# EAGLE design photodiode-opamp-tester-mk-2.0 (EAGLE 7.5.0)
AUTHOR: sean@yak.net
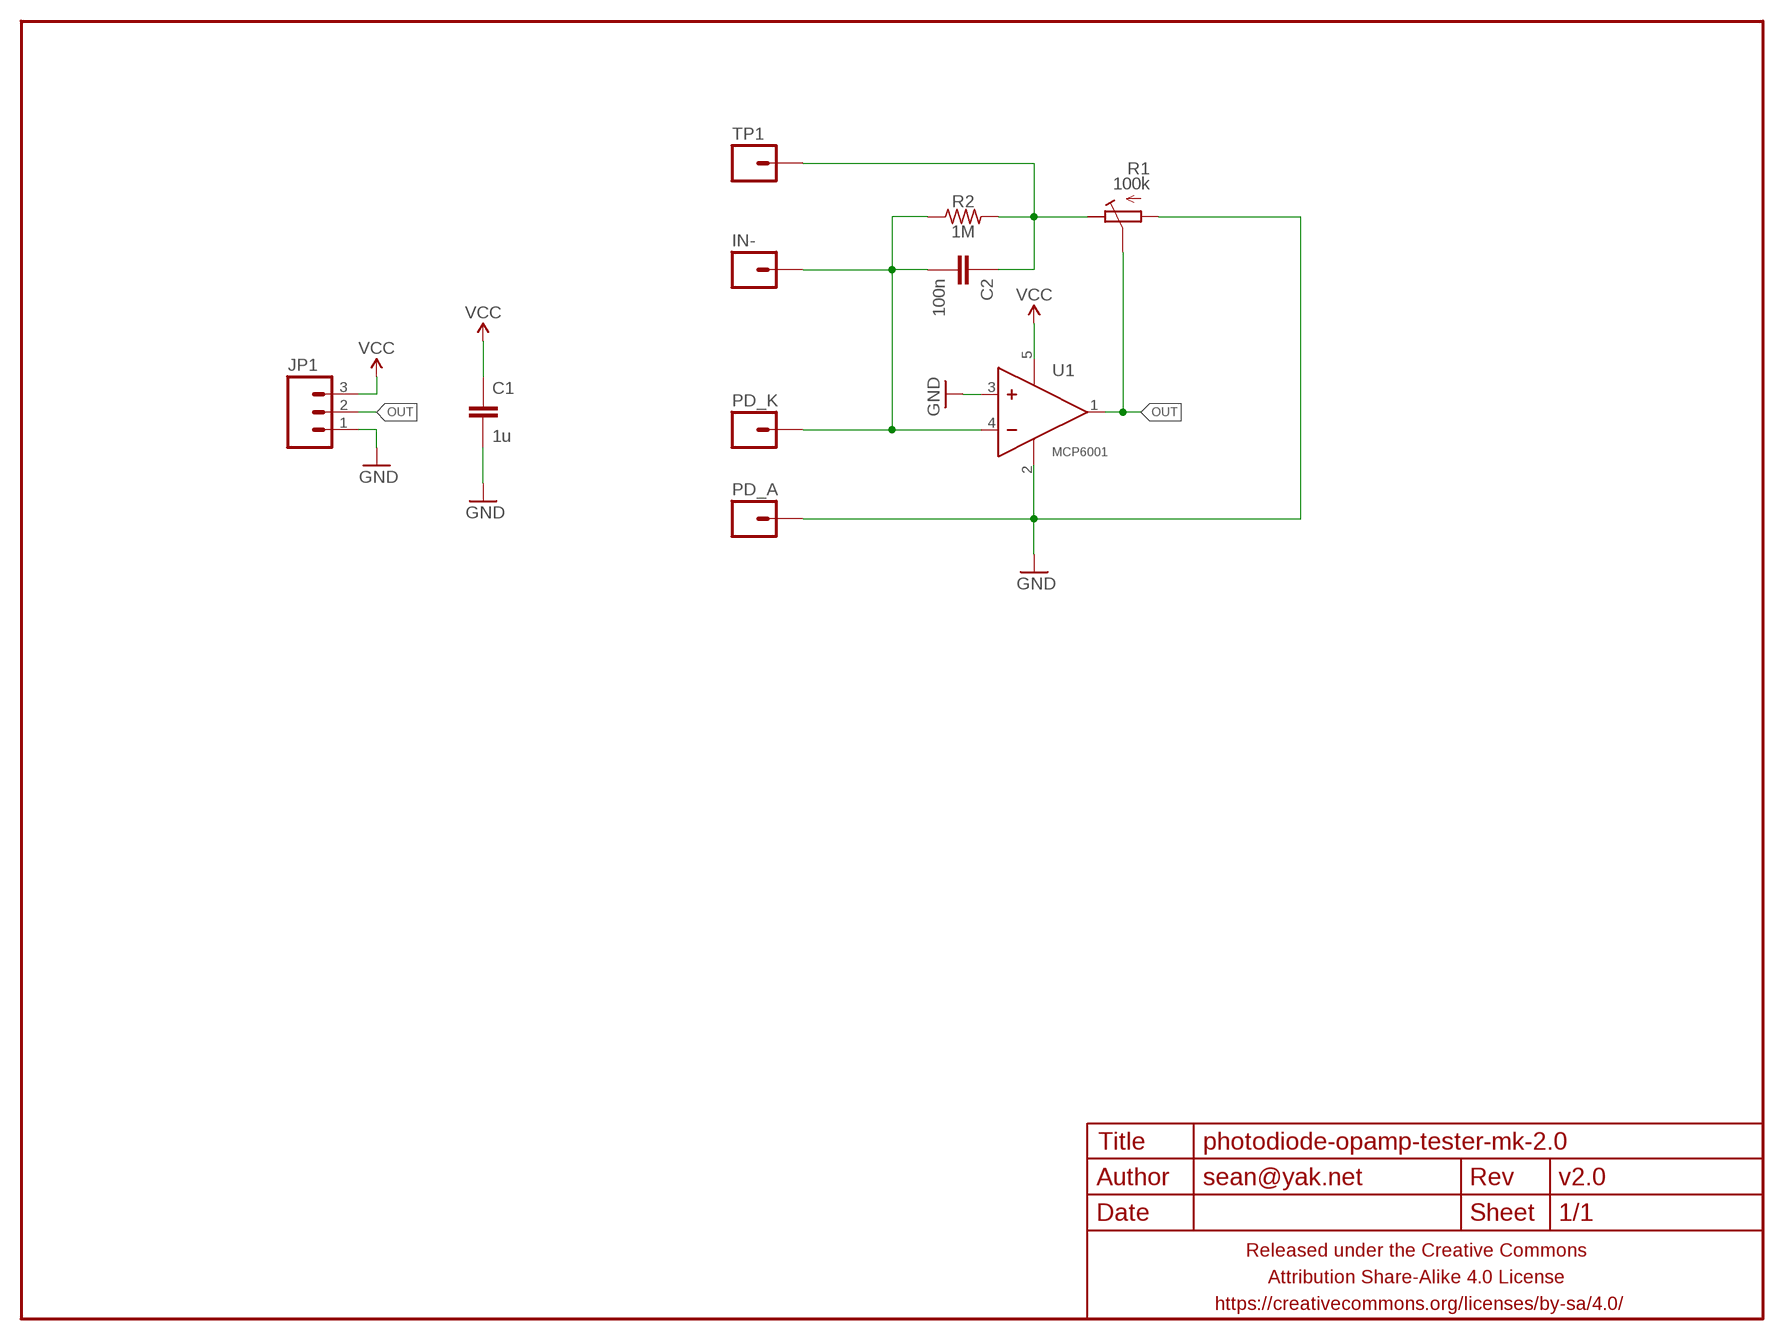
[diagram p0: schematic, sheet 1]

## Parts
C1  1u  CAPACITOR-CERAMICC0603  [C0603]
C2  100n  CAPACITOR-CERAMICC0603  [C0603]
FRAME1  FRAME-LETTERNO_PACKAGE  [DUMMY]
IN-  M01OFFSET  [1X01_OFFSET]
JP1  M03PTH-CENTERED  [1X03-CENTERED]
PD_A  M01PTH-1.2MM-OCT  [1X01-1.2MM-OCT]
PD_K  M01PTH-1.2MM-OCT  [1X01-1.2MM-OCT]
R1  100k  POTENTIOMETEREVM3Y  [EVM3Y]
R2  1M  RESISTORR0603  [R0603]
TP1  M01OFFSET  [1X01_OFFSET]
U1  MCP6001  MCP6001SOT23-5  [SOT23-5]

## Nets
GND: C1.2 JP1.1 PD_A.1 R1.A U1.2(V-) U1.3(IN+)
N$2: C2.1 R1.E R2.2 TP1.1
N$3: C2.2 IN-.1 PD_K.1 R2.1 U1.4(IN-)
OUT: JP1.2 R1.S U1.1(OUT)
VCC: C1.1 JP1.3 U1.5(V+)

## Library data of the parts
C1 C2 = a_parts:CAPACITOR-CERAMIC: CAPACITOR, European symbol
FRAME1 = A_butts:FRAME-LETTER: Schematic Frame Standard 8.5x11 US Letter frame; DESIGNER: sean@yak.net; VERSION: v2.0
IN- PD_A PD_K TP1 = a_parts:M01: Header 1 Standard 1-pin 0.1" header. Use with straight break away headers (SKU : PRT-00116), right angle break away headers (PRT-00553), swiss pins (PRT-00743), machine pins (PRT-00117), and female headers (PRT-00115).
JP1 = a_parts:M03: Header 3 Standard 3-pin 0.1" header. Use with straight break away headers (SKU : PRT-00116), right angle break away headers (PRT-00553), swiss pins (PRT-00743), machine pins (PRT-00117), and female headers (PRT-00115). Molex polarized connector foot print use with SKU : PRT-08232 with associated crimp pins and housings.
R1 = a_parts:POTENTIOMETER: Trimm resistor
R2 = a_parts:RESISTOR: RESISTOR, American symbol
U1 = a_parts:MCP6001

## Board
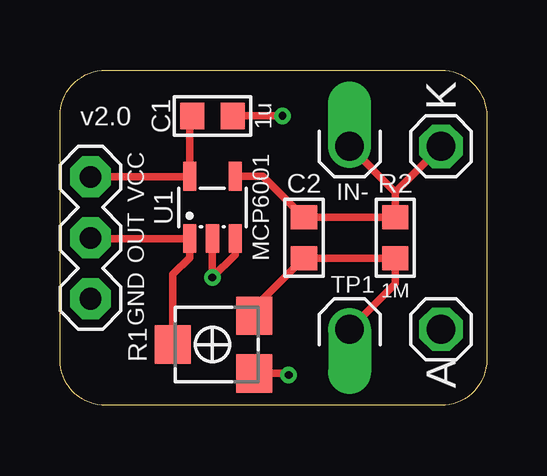
[diagram p1: board, top side]
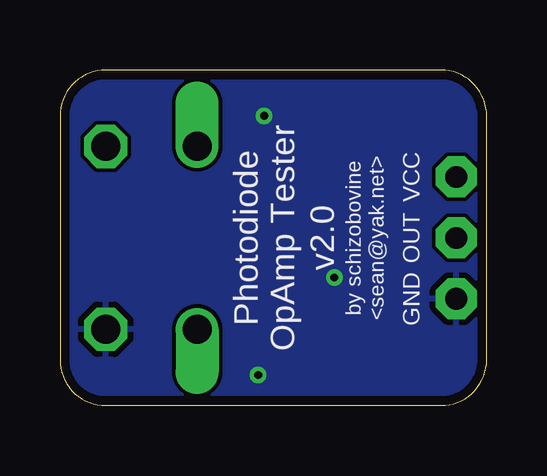
[diagram p2: board, bottom side, seen from below]

Size 17.78 x 13.97 mm. Coordinates in mm from the lower left corner, seen from the top.
Outline: 1.91,13.97 15.88,13.97 arc-90 17.78,12.06 17.78,1.91 arc-90 15.88,0 1.91,0 arc-90 0,1.91 0,12.06 arc-90 1.91,13.97
Copper layers (1*16): Top 0.0356mm / dielectric 1.5011mm / Bottom 0.0356mm
Design rules "LaenPCBOrder_2": minimum track width 6mil, minimum drill 13mil, track to track 6mil, track to pad 6mil, pad to pad 6mil, via to via 6mil, smd to smd 6mil, copper to edge 15mil, drill to drill 6mil, minimum pad ring 7mil, minimum via ring 7mil, stop-mask expansion 3mil, vias tented up to drill 20mil, thermal gap 10mil

### Footprints (pad centres in the part's own frame; a part is rotated, then mirrored left to right if it is on the bottom)
C0603 = smd 1 x 1.1: 1 -0.85,0; 2 0.85,0
1X01_OFFSET = drill 1.2 pad 1.778 offset: 1 0,0
1X03-CENTERED = drill 0.9 pad 1.7 octagon: 1 -2.54,0; 2 0,0; 3 2.54,0
1X01-1.2MM-OCT = drill 1.2 pad 1.778 octagon: 1 0,0
EVM3Y = smd 1.6 x 1.5: A -1.2,-1.75; E 1.2,-1.75; S 0,1.65
R0603 = smd 1 x 1.1: 1 -0.85,0; 2 0.85,0
SOT23-5 = smd 0.55 x 1.2: 1 -0.95,-1.3; 2 0,-1.3; 3 0.95,-1.3; 4 0.95,1.3; 5 -0.95,1.3

### Placement (x,y rotation side)
C1  6.35,12.06 0 top
C2  10.16,6.99 90 top
FRAME1  0,0 90 bottom
IN-  12.06,10.79 0 top
JP1  1.27,6.99 90 top
PD_A  15.88,3.17 270 top
PD_K  15.88,10.79 270 top
R1  6.35,2.54 90 top
R2  13.97,6.99 270 top
TP1  12.06,3.17 180 top
U1  6.35,8.26 0 top

### Tracks (layer width: path | path; a pad name or v marks a point on that pad's centre or on a via)
GND  (via drill 0.33)
  Top 0.305: U1.2 v6.35,5.33 7.3,6.28 U1.3 | C1.2 v9.27,12.06 | R1.A 9.46,1.34 v9.53,1.27
  pour Bottom (rank 6): 1.91,13.97 15.88,13.97 arc-90 17.78,12.06 17.78,1.91 arc-90 15.88,0 1.91,0 arc-90 0,1.91 0,12.06 arc-90
N$2
  Top 0.305: R1.E 8.1,4.08 C2.1 R2.2 13.97,5.08 TP1.1
N$3
  Top 0.305: U1.4 8.44,9.55 C2.2 R2.1 13.97,8.89 | PD_K.1 13.97,8.89 | IN-.1 13.97,8.89
OUT
  Top 0.305: JP1.2 1.3,6.96 U1.1 5.4,6.16 4.7,5.46 R1.S
VCC
  Top 0.305: JP1.3 5.37,9.53 U1.5 5.4,11.96 C1.1

### Text on the board
tPlace: K | VCC | OUT | GND | A
bPlace: VCC | OUT | by schizobovine / <sean@yak.net> | Photodiode / OpAmp Tester | GND